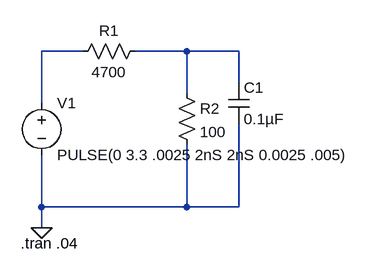
[diagram p0: schematic Cap_Edge_Soften.asc]
Cap_Edge_Soften.asc, the LTspice schematic file:
Version 4
SHEET 1 880 680
WIRE 144 48 80 48
WIRE 304 48 224 48
WIRE 384 48 304 48
WIRE 384 96 384 48
WIRE 304 112 304 48
WIRE 80 128 80 48
WIRE 80 288 80 208
WIRE 304 288 304 192
WIRE 304 288 80 288
WIRE 384 288 384 160
WIRE 384 288 304 288
WIRE 80 320 80 288
FLAG 80 320 0
SYMBOL voltage 80 112 R0
WINDOW 123 0 0 Left 0
WINDOW 39 0 0 Left 0
SYMATTR InstName V1
SYMATTR Value PULSE(0 3.3 .0025 2nS 2nS 0.0025 .005)
SYMBOL res 240 32 R90
WINDOW 0 0 56 VBottom 2
WINDOW 3 32 56 VTop 2
SYMATTR InstName R1
SYMATTR Value 4700
SYMBOL cap 368 96 R0
SYMATTR InstName C1
SYMATTR Value 0.1µF
SYMBOL res 288 96 R0
SYMATTR InstName R2
SYMATTR Value 100
TEXT 48 344 Left 2 !.tran .04

The netlist it stands for:
* Cap_Edge_Soften.asc
V1 N001 0 PULSE(0 3.3 .0025 2nS 2nS 0.0025 .005)
R1 N002 N001 4700
C1 N002 0 0.1µF
R2 N002 0 100
.tran .04
.backanno
.end